# EAGLE schematic untitled (EAGLE 9.0.1)
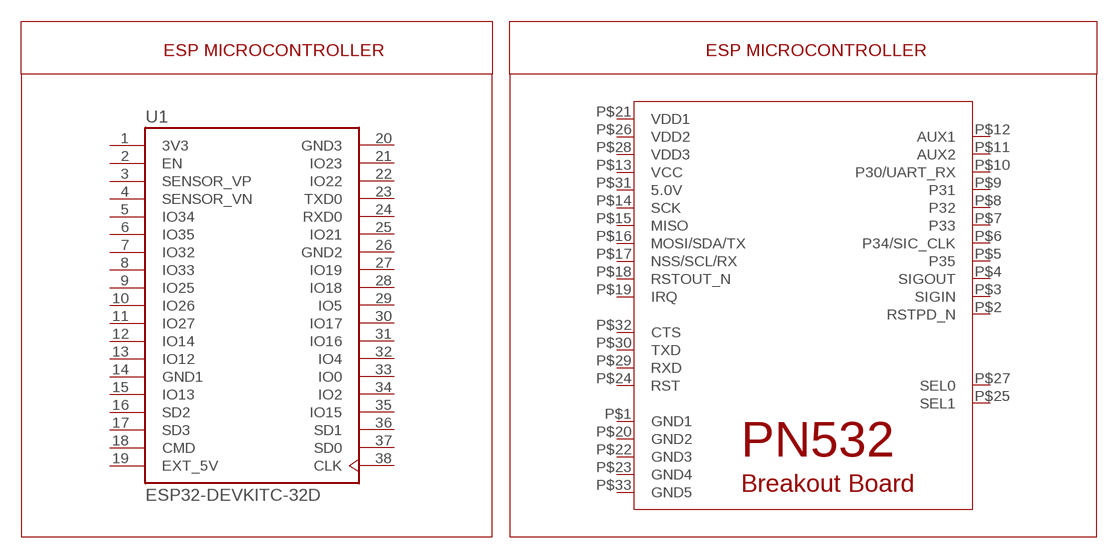
[diagram p0: schematic, sheet 1]

## Parts
U1  ESP32-DEVKITC-32D  [MODULE_ESP32-DEVKITC-32D]
U$1  PN532-ADAFRUIT-BREAKOUT  [RFID]
Unconnected: U1.2(EN) U1.3(SENSOR_VP) U1.4(SENSOR_VN) U1.5(IO34) U1.6(IO35) U1.7(IO32) U1.8(IO33) U1.9(IO25) U1.10(IO26) U1.11(IO27) U1.12(IO14) U1.13(IO12) U1.15(IO13) U1.16(SD2) U1.17(SD3) U1.18(CMD) U1.21(IO23) U1.22(IO22) U1.23(TXD0) U1.24(RXD0) U1.25(IO21) U1.27(IO19) U1.28(IO18) U1.29(IO5) U1.30(IO17) U1.31(IO16) U1.32(IO4) U1.33(IO0) U1.34(IO2) U1.35(IO15) U1.36(SD1) U1.37(SD0) U1.38(CLK) U$1.P$1(GND1) U$1.P$2(RSTPD_N) U$1.P$3(SIGIN) U$1.P$4(SIGOUT) U$1.P$5(P35) U$1.P$6(P34/SIC_CLK) U$1.P$7(P33) U$1.P$8(P32) U$1.P$9(P31) U$1.P$10(P30/UART_RX) U$1.P$11(AUX2) U$1.P$12(AUX1) U$1.P$13(VCC) U$1.P$14(SCK) U$1.P$15(MISO) U$1.P$16(MOSI/SDA/TX) U$1.P$17(NSS/SCL/RX) U$1.P$18(RSTOUT_N) U$1.P$19(IRQ) U$1.P$20(GND2) U$1.P$21(VDD1) U$1.P$22(GND3) U$1.P$23(GND4) U$1.P$24(RST) U$1.P$25(SEL1) U$1.P$26(VDD2) U$1.P$27(SEL0) U$1.P$28(VDD3) U$1.P$29(RXD) U$1.P$30(TXD) U$1.P$31(5.0V) U$1.P$32(CTS) U$1.P$33(GND5)

## Notes on the sheet
- ESP MICROCONTROLLER | ESP MICROCONTROLLER

## Power pins joined to a net without a drawn wire
3V3: U1.1(3V3)
EXT_5V: U1.19(EXT_5V)
GND1: U1.14(GND1)
GND2: U1.26(GND2)
GND3: U1.20(GND3)

## Library data of the parts
U1 = ESP32-DEVKITC-32D:ESP32-DEVKITC-32D: Eval Board For Esp-Wroom-32; AVAILABILITY: Unavailable; DESCRIPTION: - Transceiver; 802.11 b/g/n _Wi-Fi, WiFi, WLAN_, Bluetooth® Smart Ready 4.x Dual Mode For Use With ESP-WROOM-32; MF: Espressif Systems; MP: ESP32-DEVKITC-32D; PACKAGE: None; PRICE: None
U$1 = RFID-Custom:PN532-ADAFRUIT-BREAKOUT